# EAGLE schematic v1.0 (EAGLE 9.4.2)
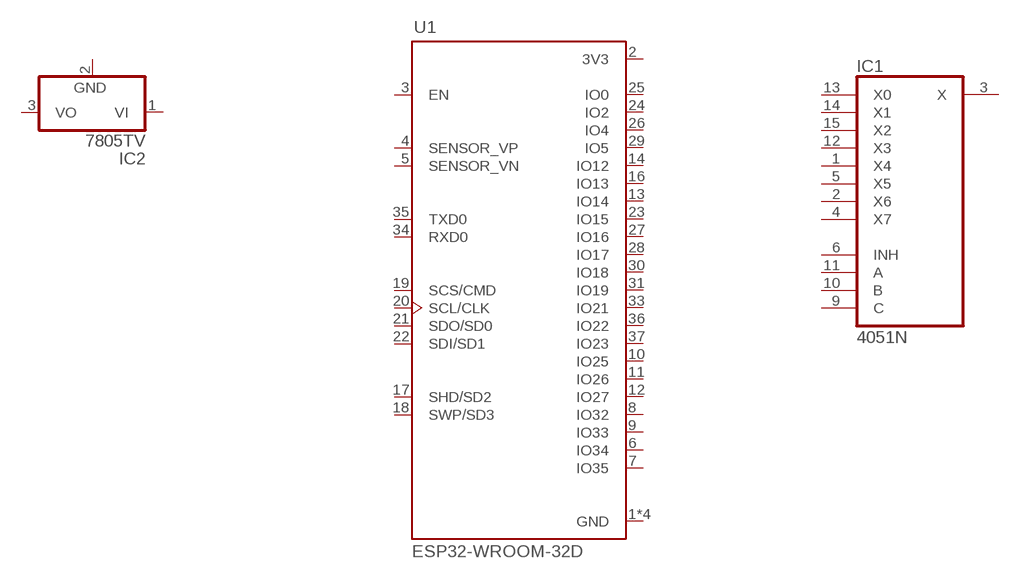
[diagram p0: schematic, sheet 1]

## Parts
IC1  4051N  [DIL16]
IC2  7805TV  [TO220V]
U1  ESP32-WROOM-32D  [MODULE_ESP32-WROOM-32D]
Unconnected: IC1.1(X4) IC1.2(X6) IC1.3(X) IC1.4(X7) IC1.5(X5) IC1.6(INH) IC1.9(C) IC1.10(B) IC1.11(A) IC1.12(X3) IC1.13(X0) IC1.14(X1) IC1.15(X2) IC2.1(VI) IC2.2(GND) IC2.3(VO) U1.3(EN) U1.4(SENSOR_VP) U1.5(SENSOR_VN) U1.6(IO34) U1.7(IO35) U1.8(IO32) U1.9(IO33) U1.10(IO25) U1.11(IO26) U1.12(IO27) U1.13(IO14) U1.14(IO12) U1.16(IO13) U1.17(SHD/SD2) U1.18(SWP/SD3) U1.19(SCS/CMD) U1.20(SCL/CLK) U1.21(SDO/SD0) U1.22(SDI/SD1) U1.23(IO15) U1.24(IO2) U1.25(IO0) U1.26(IO4) U1.27(IO16) U1.28(IO17) U1.29(IO5) U1.30(IO18) U1.31(IO19) U1.33(IO21) U1.34(RXD0) U1.35(TXD0) U1.36(IO22) U1.37(IO23)

## Power pins joined to a net without a drawn wire
3V3: U1.2(3V3)
GND: IC1.8(GND) U1.1(GND) U1.15(GND) U1.38(GND) U1.39(GND)
VCC: IC1.16(VCC)
VEE: IC1.7(VEE)

## Library data of the parts
IC1 = 40xx:4051: 8-channel ANALOG MULTIPLEXER
IC2 = linear:78*: Positive VOLTAGE REGULATOR Source: http://cache.national.com/ds/LM/LM78L05.pdf http://www.fairchildsemi.com/ds/LM/LM7805.pdf
U1 = ESP32-WROOM-32D:ESP32-WROOM-32D: IC: SoC; GPIO, I2C, I2S, IR, SD, SDIO, SPI, UART; 2.7÷3.6VDC; 20dBm; AVAILABILITY: Unavailable; DESCRIPTION: IC: SoC; GPIO, I2C, I2S, IR, SD, SDIO, SPI, UART; 2.7÷3.6VDC; 20dBm; MF: Espressif Systems; MP: ESP32-WROOM-32D; PACKAGE: Module Espressif Systems; PRICE: None